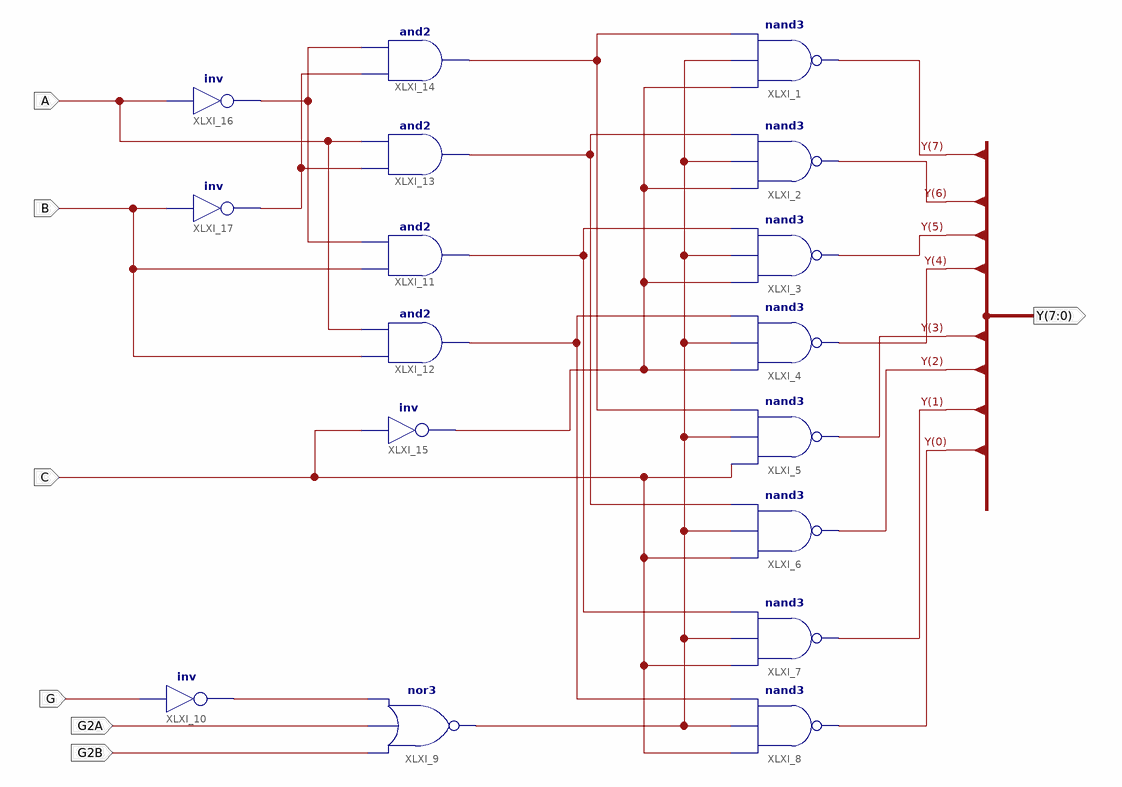
[diagram p0: schematic sheet 1]
// Xilinx ISE schematic D_74LS138.sch (kintex7) as structural Verilog: 17 symbols, 7 ports
module D_74LS138 (
  input  A,
  input  B,
  input  G,
  input  G2A,
  input  G2B,
  input  C,
  output [7:0] Y
);

  wire XLXN_4, XLXN_17, XLXN_20, XLXN_25, XLXN_29, XLXN_31, XLXN_33, XLXN_35, XLXN_46;

  nand XLXI_1 (Y[7], XLXN_46, XLXN_17, XLXN_29);
  nand XLXI_2 (Y[6], XLXN_46, XLXN_17, XLXN_31);
  nand XLXI_3 (Y[5], XLXN_46, XLXN_17, XLXN_33);
  nand XLXI_4 (Y[4], XLXN_46, XLXN_17, XLXN_35);
  nand XLXI_5 (Y[3], C, XLXN_17, XLXN_29);
  nand XLXI_6 (Y[2], C, XLXN_17, XLXN_31);
  nand XLXI_7 (Y[1], C, XLXN_17, XLXN_33);
  nand XLXI_8 (Y[0], C, XLXN_17, XLXN_35);
  nor XLXI_9 (XLXN_17, G2B, G2A, XLXN_4);
  not XLXI_10 (XLXN_4, G);
  and XLXI_11 (XLXN_33, B, XLXN_20);
  and XLXI_12 (XLXN_35, B, A);
  and XLXI_13 (XLXN_31, XLXN_25, A);
  and XLXI_14 (XLXN_29, XLXN_25, XLXN_20);
  not XLXI_15 (XLXN_46, C);
  not XLXI_16 (XLXN_20, A);
  not XLXI_17 (XLXN_25, B);
endmodule
